# Altium schematic sheet MCU.SchDoc
size A4; SheetNumber: 1; SheetTotal: 6; SPICEModelCacheQSCFDVKM: <root> / <DocumentId>QSCFDVKM</DocumentId> / <CacheFrame Number="0"> / <Model Name="0805_150080gs75000" Kind="CKT"> / <Text>****** / .subckt 0805_150080GS75000  1  2 / D1 1 2 SMCW / .MODEL SMCW D / + IS=906.98E-12 / + N=4.4982 / + RS=1.5743 / + IKF=518.93E-9 / + CJO=1.0000E-12 / + M=.3333 / + VJ=.75 / + BV=5 / + IBV=10.00E-6 / + TT=5.0000E-9 / .ends</Text> / </Model> / <Model Name="0603_885012206071_100nf" Kind="CKT"> / <Text>******* / .subckt 0603_885012206071_100nF 1 2 / Rser 1 3 0.025 / Lser 2 4 0.0000000008 / C1 3 4 0.0000001 / Rpar 3 4 5000000000 / .ends 0603_885012206071_100nF</Text> / </Model> / <Model Name="0805_150080ys75000" Kind="CKT"> / <Text>****** / .subckt 0805_150080YS75000  1  2 / D1 1 2 SMCW / .MODEL SMCW D / + IS=10.000E-21 / + N=1.8000 / + RS=1.0003E-6 / + IKF=1.8092E-3 / + CJO=1.0000E-12 / + M=.3333 / + VJ=.75 / + BV=5 / + IBV=10.00E-6 / + TT=5.0000E-9 / .ends</Text> / </Model> / </CacheFrame> / </root>
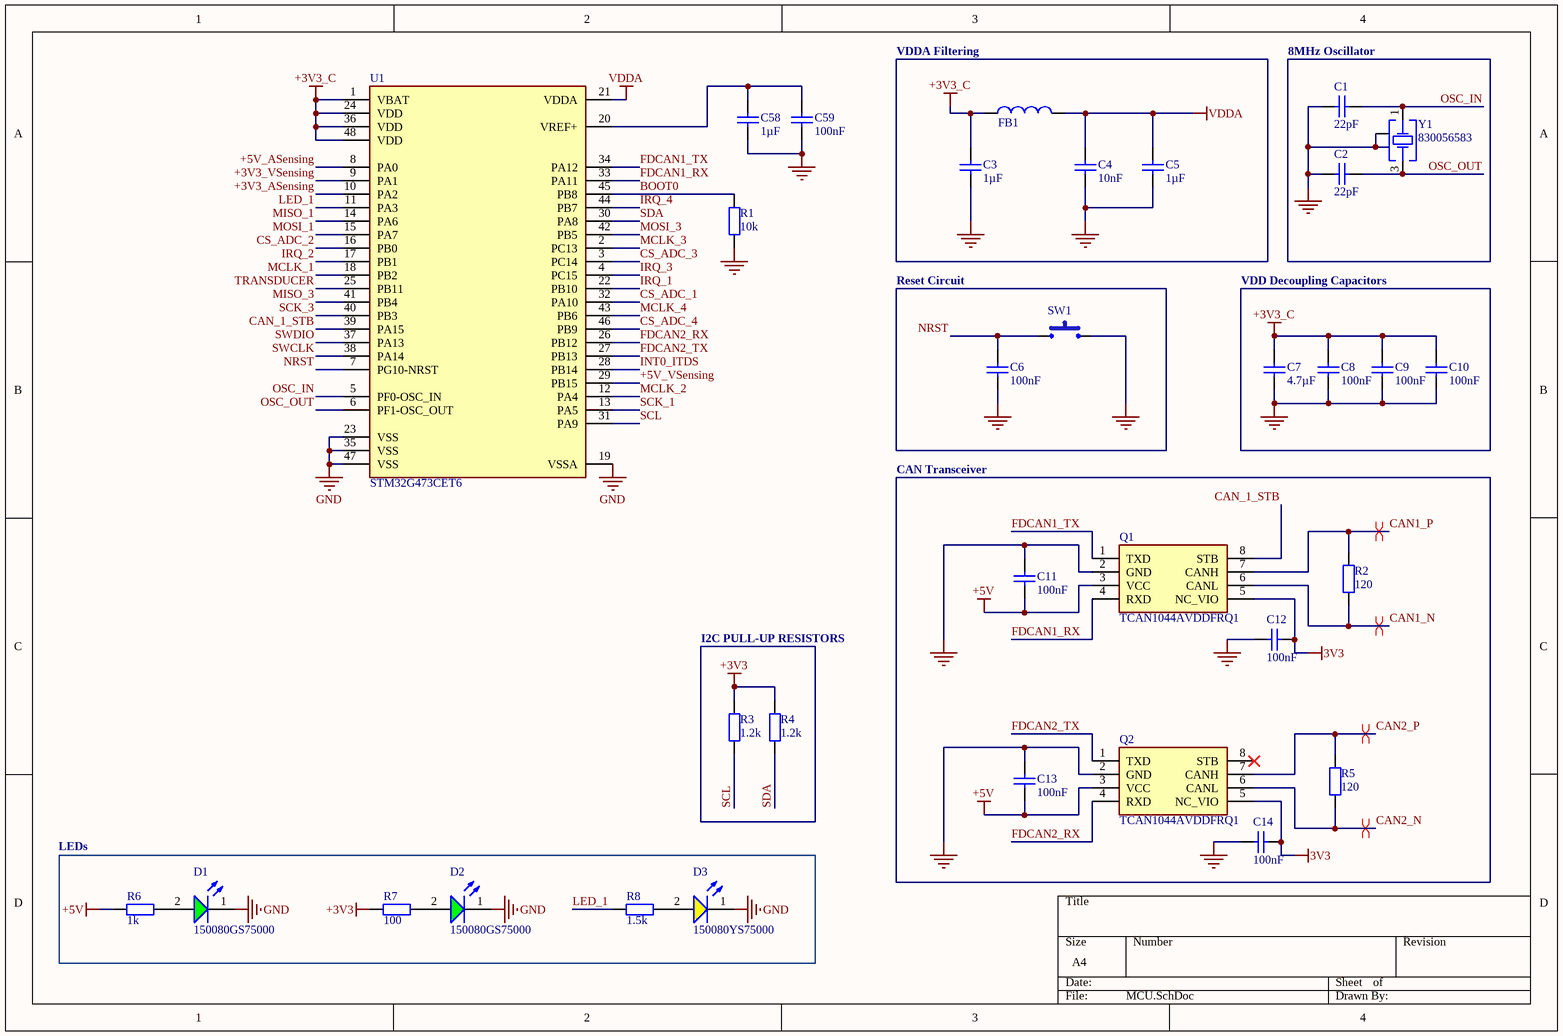
[diagram p0: MCU.SchDoc]

## Parts
C1  value 22pF  [WCAP-CSGP_0603_L1.6W0.8H0.8_Reflow]  (hidden comment: 885012006034)
C2  value 22pF  [WCAP-CSGP_0603_L1.6W0.8H0.8_Reflow]  (hidden comment: 885012006034)
C3  value 1µF  [WCAP-CSGP_0603_L1.6W0.8H0.8_Reflow]  (hidden comment: 885012206052)
C4  value 10nF  [WCAP-CSGP_0603_L1.6W0.8H0.8_Reflow]  (hidden comment: 885012206065)
C5  value 1µF  [WCAP-CSGP_0603_L1.6W0.8H0.8_Reflow]  (hidden comment: 885012206052)
C6  value 100nF  [WCAP-CSGP_0603_L1.6W0.8H0.8_Reflow]  (hidden comment: 885012206071)
C7  value 4.7µF  [WCAP-CSGP_0603_L1.6W0.8H0.8_Reflow]  (hidden comment: 885012106012)
C8  value 100nF  [WCAP-CSGP_0603_L1.6W0.8H0.8_Reflow]  (hidden comment: 885012206071)
C9  value 100nF  [WCAP-CSGP_0603_L1.6W0.8H0.8_Reflow]  (hidden comment: 885012206071)
C10  value 100nF  [WCAP-CSGP_0603_L1.6W0.8H0.8_Reflow]  (hidden comment: 885012206071)
C11  value 100nF  [WCAP-CSGP_0603_L1.6W0.8H0.8_Reflow]  (hidden comment: 885012206071)
C12  value 100nF  [WCAP-CSGP_0603_L1.6W0.8H0.8_Reflow]  (hidden comment: 885012206071)
C13  value 100nF  [WCAP-CSGP_0603_L1.6W0.8H0.8_Reflow]  (hidden comment: 885012206071)
C14  value 100nF  [WCAP-CSGP_0603_L1.6W0.8H0.8_Reflow]  (hidden comment: 885012206071)
C58  value 1µF  [WCAP-CSGP_0603_L1.6W0.8H0.8_Reflow]  (hidden comment: 885012206052)
C59  value 100nF  [WCAP-CSGP_0603_L1.6W0.8H0.8_Reflow]  (hidden comment: 885012206071)
D1  150080GS75000  [WL-SMCW_0805_150080xx75000]
D2  150080GS75000  [WL-SMCW_0805_150080xx75000]
D3  150080YS75000  [WL-SMCW_0805_150080xx75000]
FB1  742792625  [WE-CBF_0603_L1.6W0.8H0.8_HC]  (value not drawn)
Q1  TCAN1044AVDDFRQ1  [FP-DDF0008A-MFG]
Q2  TCAN1044AVDDFRQ1  [FP-DDF0008A-MFG]
R1  value 10k  [WRIS-RSKS_0603_Reflow]  (hidden comment: 560112116005)
R2  value 120  [RCS0805120RFKEA-Footprint-1]  (hidden comment: RCS0805120RFKEA)
R3  value 1.2k  [WRIS-RSKS_0603_Reflow]  (hidden comment: 560112116070)
R4  value 1.2k  [WRIS-RSKS_0603_Reflow]  (hidden comment: 560112116070)
R5  value 120  [RCS0805120RFKEA-Footprint-1]  (hidden comment: RCS0805120RFKEA)
R6  value 1k  [WRIS-RSKS_0603_Reflow]  (hidden comment: 560112116014)
R7  value 100  [WRIS-RSKS_0603_Reflow]  (hidden comment: 560112116009)
R8  value 1.5k  [WRIS-RSKS_0603_Reflow]  (hidden comment: 560112116038)
SW1  PTS815SJM250SMTRLFS  [PTS815SJM250SMTRLFS-Footprint-1]  (value not drawn)
U1  STM32G473CET6  [STM32G0C1RET6-Footprint-1]
Y1  830056583  [WE-XTAL_CFPX-104]

## Blocks framed on the sheet
VDDA Filtering: C3-C5 FB1
8MHz Oscillator: C1 C2 Y1
Reset Circuit: C6 SW1
VDD Decoupling Capacitors: C7-C10
CAN Transceiver: C11-C14 Q1 Q2 R2 R5
I2C PULL-UP RESISTORS: R3 R4
LEDs: D1-D3 R6-R8

## Nets
+3V3: R3.2 R4.2 R7.1
+3V3_C: C3.2 C7.2 C8.2 C9.2 C10.2 C12.1 C14.1 FB1.1 Q1.5(NC_VIO) Q2.5(NC_VIO) U1.1(VBAT) U1.24(VDD) U1.36(VDD) U1.48(VDD)  [also labelled 3V3]
+5V: C11.1 C13.1 Q1.3(VCC) Q2.3(VCC) R6.1
GND: C1.2 C2.2 C3.1 C4.1 C5.1 C6.1 C7.1 C8.1 C9.1 C10.1 C11.2 C12.2 C13.2 C14.2 C58.1 C59.1 D1.1(K) D2.1(K) D3.1(K) Q1.2(GND) Q2.2(GND) R1.1 SW1.2 U1.19(VSSA) U1.23(VSS) U1.35(VSS) U1.47(VSS) Y1.2(GND_&_Lid) Y1.4(GND_&_Lid)
VDDA: C4.2 C5.2 FB1.2 U1.21(VDDA)
+3V3_ASensing: U1.10(PA2)
+3V3_VSensing: U1.9(PA1)
+5V_ASensing: U1.8(PA0)
+5V_VSensing: U1.29(PB15)
BOOT0: R1.2 U1.45(PB8)
CAN1_N: Q1.6(CANL) R2.1
CAN1_P: Q1.7(CANH) R2.2
CAN2_N: Q2.6(CANL) R5.1
CAN2_P: Q2.7(CANH) R5.2
CAN_1_STB: Q1.8(STB) U1.39(PA15)
CS_ADC_1: U1.32(PA10)
CS_ADC_2: U1.16(PB0)
CS_ADC_3: U1.3(PC14)
CS_ADC_4: U1.46(PB9)
FDCAN1_RX: Q1.4(RXD) U1.33(PA11)
FDCAN1_TX: Q1.1(TXD) U1.34(PA12)
FDCAN2_RX: Q2.4(RXD) U1.26(PB12)
FDCAN2_TX: Q2.1(TXD) U1.27(PB13)
INT0_ITDS: U1.28(PB14)
IRQ_1: U1.22(PB10)
IRQ_2: U1.17(PB1)
IRQ_3: U1.4(PC15)
IRQ_4: U1.44(PB7)
LED_1: R8.1 U1.11(PA3)
MCLK_1: U1.18(PB2)
MCLK_2: U1.12(PA4)
MCLK_3: U1.2(PC13)
MCLK_4: U1.43(PB6)
MISO_1: U1.14(PA6)
MISO_3: U1.41(PB4)
MOSI_1: U1.15(PA7)
MOSI_3: U1.42(PB5)
NRST: C6.2 SW1.1 U1.7(PG10-NRST)
OSC_IN: C1.1 U1.5(PF0-OSC_IN) Y1.1(Crystal)
OSC_OUT: C2.1 U1.6(PF1-OSC_OUT) Y1.3(Crystal)
SCK_1: U1.13(PA5)
SCK_3: U1.40(PB3)
SCL: R3.1 U1.31(PA9)
SDA: R4.1 U1.30(PA8)
SWCLK: U1.38(PA14)
SWDIO: U1.37(PA13)
TRANSDUCER: U1.25(PB11)
NetC58_2: C58.2 C59.2 U1.20(VREF+)
NetD1_2: D1.2(A) R6.2
NetD2_2: D2.2(A) R7.2
NetD3_2: D3.2(A) R8.2

Not connected (* = marked no-connect by the designer): Q2 8(STB)*

## Layout directives
differential pair: CAN1_N, CAN1_P, CAN2_N, CAN2_P

## Library data of the parts
C1 C2 = CMP-001-00150-1: WCAP-CSGP Multilayer Ceramic Chip Capacitor, General Purpose, size 0603, NP0, 22pF, 25VDC; Manufacturer: Wurth Elektronik; Q Factor: 840; Capacitance Tolerance: +/-5%; Insulation Resistance: 10GOhm; Technical Reference: NP00603220J025DFCT10000; Rated Voltage (DC): 25V; Category: Multilayer Ceramic Chip Capacitors; ComponentLink2URL: https://www.we-online.com/redexpert/spec/885012006034?ad; ComponentLink1Description: Website Link; Operating Temperature Max: 125°C; Ceramic Type: NP0; Operating Temperature Min: -55°C; Case/Package: 0603; Component Type: Standard; Width: 0.8mm; Source: WCAP-CSGP.SchLib; Pins: 2; Packaging: Tape and Reel; Mount: Surface Mount; ComponentLink2Description: Datasheet Link; ComponentLink1URL: https://www.we-online.com/redexpert/article/885012006034?ad; Manufacturer Part Number: 885012006034; Match Code: WCAP-CSGP; Design Item ID: 885012006034; Length: 1.6mm; Height: 0.8mm
C3 C5 C58 = CMP-001-00642-1: WCAP-CSGP Multilayer Ceramic Chip Capacitor, General Purpose, size 0603, X7R, 1uF, 16VDC; Manufacturer: Wurth Elektronik; Capacitance Tolerance: +/-10%; Insulation Resistance: 0.1GOhm; Rated Voltage (DC): 16V; Dissipation Factor: 10%; Technical Reference: X7R0603105K016DFCT10000; Component Type: Standard; Width: 0.8mm; Ceramic Type: X7R; ComponentLink1Description: Website Link; ComponentLink1URL: https://www.we-online.com/redexpert/article/885012206052?ad; Height: 0.8mm; Manufacturer Part Number: 885012206052; Match Code: WCAP-CSGP; Source: WCAP-CSGP.SchLib; Case/Package: 0603; Operating Temperature Min: -55°C; ComponentLink2Description: Datasheet Link; Design Item ID: 885012206052; ComponentLink2URL: https://www.we-online.com/redexpert/spec/885012206052?ad; Category: Multilayer Ceramic Chip Capacitors; Packaging: Tape and Reel; Pins: 2; Length: 1.6mm; Operating Temperature Max: 125°C; Mount: Surface Mount
C4 = CMP-001-00655-1: WCAP-CSGP Multilayer Ceramic Chip Capacitor, General Purpose, size 0603, X7R, 10nF, 25VDC; Manufacturer: Wurth Elektronik; Dissipation Factor: 3.5%; Technical Reference: X7R0603103K025DFCT10000; Capacitance Tolerance: +/-10%; Insulation Resistance: 10GOhm; Rated Voltage (DC): 25V; ComponentLink1Description: Website Link; Packaging: Tape and Reel; Match Code: WCAP-CSGP; Ceramic Type: X7R; ComponentLink1URL: https://www.we-online.com/redexpert/article/885012206065?ad; ComponentLink2URL: https://www.we-online.com/redexpert/spec/885012206065?ad; Component Type: Standard; Case/Package: 0603; Operating Temperature Min: -55°C; ComponentLink2Description: Datasheet Link; Category: Multilayer Ceramic Chip Capacitors; Pins: 2; Mount: Surface Mount; Height: 0.8mm; Source: WCAP-CSGP.SchLib; Length: 1.6mm; Design Item ID: 885012206065; Operating Temperature Max: 125°C; Width: 0.8mm; Manufacturer Part Number: 885012206065
C6 C8-C14 C59 = CMP-001-00661-1: WCAP-CSGP Multilayer Ceramic Chip Capacitor, General Purpose, size 0603, X7R, 100nF, 25VDC; Manufacturer: Wurth Elektronik; Dissipation Factor: 3.5%; Capacitance Tolerance: +/-10%; Insulation Resistance: 5GOhm; Technical Reference: X7R0603104K025DFCT10000; Rated Voltage (DC): 25V; Packaging: Tape and Reel; Height: 0.8mm; Mount: Surface Mount; Source: WCAP-CSGP.SchLib; Component Type: Standard; Category: Multilayer Ceramic Chip Capacitors; Operating Temperature Min: -55°C; Case/Package: 0603; ComponentLink2Description: Datasheet Link; Width: 0.8mm; ComponentLink1URL: https://www.we-online.com/redexpert/article/885012206071?ad; Length: 1.6mm; Operating Temperature Max: 125°C; Match Code: WCAP-CSGP; ComponentLink2URL: https://www.we-online.com/redexpert/spec/885012206071?ad; Design Item ID: 885012206071; ComponentLink1Description: Website Link; Manufacturer Part Number: 885012206071; Pins: 2; Ceramic Type: X7R
C7 = CMP-001-00440-1: WCAP-CSGP Multilayer Ceramic Chip Capacitor, General Purpose, size 0603, X5R, 4.7uF, 10VDC; Manufacturer: Wurth Elektronik; Rated Voltage (DC): 10V; Technical Reference: X5R0603475M010DFCT10000; Dissipation Factor: 10%; Insulation Resistance: 0.02GOhm; Capacitance Tolerance: +/-20%; ComponentLink2URL: https://www.we-online.com/redexpert/spec/885012106012?ad; Height: 0.8mm; Packaging: Tape and Reel; Case/Package: 0603; Manufacturer Part Number: 885012106012; Component Type: Standard; Width: 0.8mm; Match Code: WCAP-CSGP; Mount: Surface Mount; Ceramic Type: X5R; Operating Temperature Max: 85°C; ComponentLink1Description: Website Link; Length: 1.6mm; ComponentLink1URL: https://www.we-online.com/redexpert/article/885012106012?ad; ComponentLink2Description: Datasheet Link; Category: Multilayer Ceramic Chip Capacitors; Source: WCAP-CSGP.SchLib; Operating Temperature Min: -55°C; Pins: 2; Design Item ID: 885012106012
D1 D2 = CMP-004-00452-1: WL-SMCW Mono-color Chip LED Waterclear, SMT, size 0805, Green, 3.2V, 140°; Manufacturer: Wurth Elektronik; Dominant Wavelength: 525nm; Chip Technology: InGaN; Luminous Intensity: 450mcd; Peak Wavelength: 515nm; Viewing Angle: 140°; Source: WL-SMCW.SchLib; Category: Signal LEDs; Design Item ID: 150080GS75000; ComponentLink1URL: https://www.we-online.com/redexpert/article/150080GS75000?ad; Pins: 2; Emitting Color: Green; Mount: Surface Mount; ComponentLink2URL: https://www.we-online.com/redexpert/spec/150080GS75000?ad; Match Code: WL-SMCW; ComponentLink1Description: Website Link; Operating Temperature Max: 85°C; Case/Package: 0805; Manufacturer Part Number: 150080GS75000; Forward Voltage: 3.2V; Operating Temperature Min: -40°C; Component Type: Standard; Height: 0.7mm; Length: 2mm; Width: 1.25mm; Packaging: Tape and Reel; ComponentLink2Description: Datasheet Link
D3 = CMP-004-00456-1: WL-SMCW Mono-color Chip LED Waterclear, SMT, size 0805, Yellow, 2V, 140°; Manufacturer: Wurth Elektronik; Chip Technology: AlInGaP; Peak Wavelength: 595nm; Luminous Intensity: 120mcd; Dominant Wavelength: 590nm; ComponentLink1URL: https://www.we-online.com/redexpert/article/150080YS75000?ad; Match Code: WL-SMCW; Design Item ID: 150080YS75000; ComponentLink2Description: Datasheet Link; Mount: Surface Mount; Emitting Color: Yellow; Pins: 2; Case/Package: 0805; Viewing Angle: 140°; Packaging: Tape and Reel; Width: 1.25mm; ComponentLink2URL: https://www.we-online.com/redexpert/spec/150080YS75000?ad; Length: 2mm; Forward Voltage: 2V; Source: WL-SMCW.SchLib; Operating Temperature Max: 85°C; Manufacturer Part Number: 150080YS75000; Component Type: Standard; Operating Temperature Min: -40°C; ComponentLink1Description: Website Link; Category: Signal LEDs; Height: 0.7mm
FB1 = CMP-006-00120-1: WE-CBF SMT EMI Suppression Ferrite Bead, size 0603, 120Ohm, 2A; Manufacturer: Wurth Elektronik; Impedance Max: 180Ohm; Type: High Current; Impedance Max Test Condition: 400MHz; DC Resistance Max: 0.05Ohm; Length: 1.6mm; Mount: Surface Mount; Source: WE-CBF.SchLib; ComponentLink2Description: Datasheet Link; Match Code: WE-CBF; Height: 0.8mm; Pins: 2; Manufacturer Part Number: 742792625; ComponentLink1Description: Website Link; Component Type: Standard; Packaging: Tape and Reel; Design Item ID: 742792625; Operating Temperature Max: 125°C; Operating Temperature Min: -55°C; Rated Current: 2A; ComponentLink1URL: https://www.we-online.com/redexpert/article/742792625?ad; Category: Ferrites for PCB Assembly; ComponentLink2URL: https://www.we-online.com/redexpert/spec/742792625?ad; Case/Package: 0603; Width: 0.8mm; Impedance @100MHz: 120Ohm
Q1 Q2 = CMP-015-00003-4: Enhanced automotive CAN transceiver with standby 8-SOT-23-THIN -40 to 150
R1 = CMP-009-00328-1: WRIS-RSKS Thick Film Resistor, size 0603, 10000Ohm, 100mW; Manufacturer: Wurth Elektronik; Limiting Element Voltage: 75V; Temperature Coefficient of Resistance Max: 100ppm/°C; Resistance Tolerance: +/-1%; Temperature Coefficient of Resistance Min: -100ppm/°C; ComponentLink1Description: Website Link; Case/Package: 0603; Pins: 2; Match Code: WRIS-RSKS; Operating Temperature Max: 155°C; Width: 0.8mm; Design Item ID: 560112116005; Length: 1.6mm; ComponentLink2Description: Datasheet Link; ComponentLink2URL: https://www.we-online.com/redexpert/spec/560112116005?ad; Packaging: Tape and Reel; Source: WRIS-RSKS.SchLib; Height: 0.45mm; Manufacturer Part Number: 560112116005; Component Type: Standard; Mount: Surface Mount; Operating Temperature Min: -55°C; Rated Power: 100mW; ComponentLink1URL: https://www.we-online.com/redexpert/article/560112116005?ad; Category: Thick Film Resistors
R2 R5 = CMP-009-00119-3: Fixed Resistor, Metal Glaze/thick Film, 0.4W, 120ohm, 150V, 1% +/-Tol, 100ppm/Cel, Surface Mount, 0805; Power: 500mW; Case/Package: 0805; Mounting Technology: SMD; Pins: 2
R3 R4 = CMP-009-00393-1: WRIS-RSKS Thick Film Resistor, size 0603, 1200Ohm, 100mW; Manufacturer: Wurth Elektronik; Limiting Element Voltage: 75V; Temperature Coefficient of Resistance Max: 100ppm/°C; Resistance Tolerance: +/-1%; Temperature Coefficient of Resistance Min: -100ppm/°C; Mount: Surface Mount; Pins: 2; Manufacturer Part Number: 560112116070; Case/Package: 0603; Category: Thick Film Resistors; Source: WRIS-RSKS.SchLib; ComponentLink1URL: https://www.we-online.com/redexpert/article/560112116070?ad; Length: 1.6mm; ComponentLink1Description: Website Link; ComponentLink2Description: Datasheet Link; ComponentLink2URL: https://www.we-online.com/redexpert/spec/560112116070?ad; Component Type: Standard; Width: 0.8mm; Packaging: Tape and Reel; Match Code: WRIS-RSKS; Design Item ID: 560112116070; Height: 0.45mm; Operating Temperature Min: -55°C; Operating Temperature Max: 155°C; Rated Power: 100mW
R6 = CMP-009-00337-1: WRIS-RSKS Thick Film Resistor, size 0603, 1000Ohm, 100mW; Manufacturer: Wurth Elektronik; Resistance Tolerance: +/-1%; Limiting Element Voltage: 75V; Temperature Coefficient of Resistance Min: -100ppm/°C; Temperature Coefficient of Resistance Max: 100ppm/°C; Mount: Surface Mount; Rated Power: 100mW; Packaging: Tape and Reel; Case/Package: 0603; ComponentLink1URL: https://www.we-online.com/redexpert/article/560112116014?ad; Height: 0.45mm; Manufacturer Part Number: 560112116014; ComponentLink1Description: Website Link; ComponentLink2URL: https://www.we-online.com/redexpert/spec/560112116014?ad; Source: WRIS-RSKS.SchLib; Operating Temperature Min: -55°C; Width: 0.8mm; Match Code: WRIS-RSKS; Design Item ID: 560112116014; ComponentLink2Description: Datasheet Link; Category: Thick Film Resistors; Operating Temperature Max: 155°C; Component Type: Standard; Length: 1.6mm; Pins: 2
R7 = CMP-009-00332-1: WRIS-RSKS Thick Film Resistor, size 0603, 100Ohm, 100mW; Manufacturer: Wurth Elektronik; Limiting Element Voltage: 75V; Resistance Tolerance: +/-1%; Temperature Coefficient of Resistance Max: 100ppm/°C; Temperature Coefficient of Resistance Min: -100ppm/°C; Mount: Surface Mount; Design Item ID: 560112116009; Height: 0.45mm; Category: Thick Film Resistors; Operating Temperature Min: -55°C; Width: 0.8mm; Manufacturer Part Number: 560112116009; ComponentLink2Description: Datasheet Link; Pins: 2; ComponentLink2URL: https://www.we-online.com/redexpert/spec/560112116009?ad; Component Type: Standard; Case/Package: 0603; ComponentLink1URL: https://www.we-online.com/redexpert/article/560112116009?ad; Rated Power: 100mW; ComponentLink1Description: Website Link; Operating Temperature Max: 155°C; Source: WRIS-RSKS.SchLib; Packaging: Tape and Reel; Length: 1.6mm; Match Code: WRIS-RSKS
R8 = CMP-009-00361-1: WRIS-RSKS Thick Film Resistor, size 0603, 1500Ohm, 100mW; Manufacturer: Wurth Elektronik; Temperature Coefficient of Resistance Max: 100ppm/°C; Temperature Coefficient of Resistance Min: -100ppm/°C; Limiting Element Voltage: 75V; Resistance Tolerance: +/-1%; Component Type: Standard; Pins: 2; Packaging: Tape and Reel; Design Item ID: 560112116038; Case/Package: 0603; Operating Temperature Max: 155°C; Length: 1.6mm; ComponentLink2URL: https://www.we-online.com/redexpert/spec/560112116038?ad; ComponentLink1Description: Website Link; Operating Temperature Min: -55°C; Source: WRIS-RSKS.SchLib; Height: 0.45mm; Rated Power: 100mW; Match Code: WRIS-RSKS; Mount: Surface Mount; Category: Thick Film Resistors; Manufacturer Part Number: 560112116038; ComponentLink1URL: https://www.we-online.com/redexpert/article/560112116038?ad; Width: 0.8mm; ComponentLink2Description: Datasheet Link
SW1 = CMP-011-00002-1: Keypad Switch, 1 Switches, SPST, Momentary-tactile, 0.05A, 12VDC, 2.26N, Solder Terminal, Surface Mount-straight
U1 = CMP-020-00001-7: Microcontroladores ARM (MCU) Mainstream Arm Cortex-M4+ MCU 170MHz 512Kbytes Math Accelerator High Analog
Y1 = CMP-003-00170-1: WE-XTAL Quartz Crystal, SMT, CFPX-104, 10MHz, +/-30ppm; Manufacturer: Wurth Elektronik; Load Capacitance: 12pF; Component Type: Standard; Operating Temperature Min: -40°C; Pins: 4; ComponentLink2URL: https://www.we-online.com/redexpert/spec/830056583?ad; Frequency Tolerance: +/-30ppm; Packaging: Tape and Reel; Match Code: WE-XTAL; Frequency Stability: +/-30ppm; ComponentLink1URL: https://www.we-online.com/redexpert/article/830056583?ad; Mount: Surface Mount; ComponentLink1Description: Website Link; Source: WE-XTAL.SchLib; Length: 5mm; Manufacturer Part Number: 830056583; Width: 3.2mm; Design Item ID: 830056583; Height: 1mm; Frequency: 10MHz; Operating Temperature Max: 85°C; Case/Package: CFPX-104; ComponentLink2Description: Datasheet Link; Category: Crystals